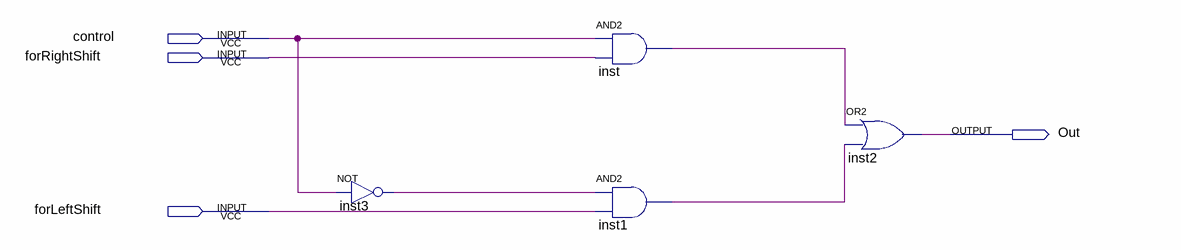
[diagram p0: schematic sheet]
// Quartus schematic Shift1.bdf as structural Verilog: 4 symbols, 4 pins
module Shift1 (
  input  control,
  input  forRightShift,
  input  forLeftShift,
  output Out
);

  wire inst1_out, inst3_out, inst_out;

  not inst3 (inst3_out, control);
  and inst (inst_out, control, forRightShift);
  and inst1 (inst1_out, inst3_out, forLeftShift);
  or inst2 (Out, inst_out, inst1_out);
endmodule
